# Altium schematic sheet PIEZO_ver2_sheet1.SchDoc
size A4
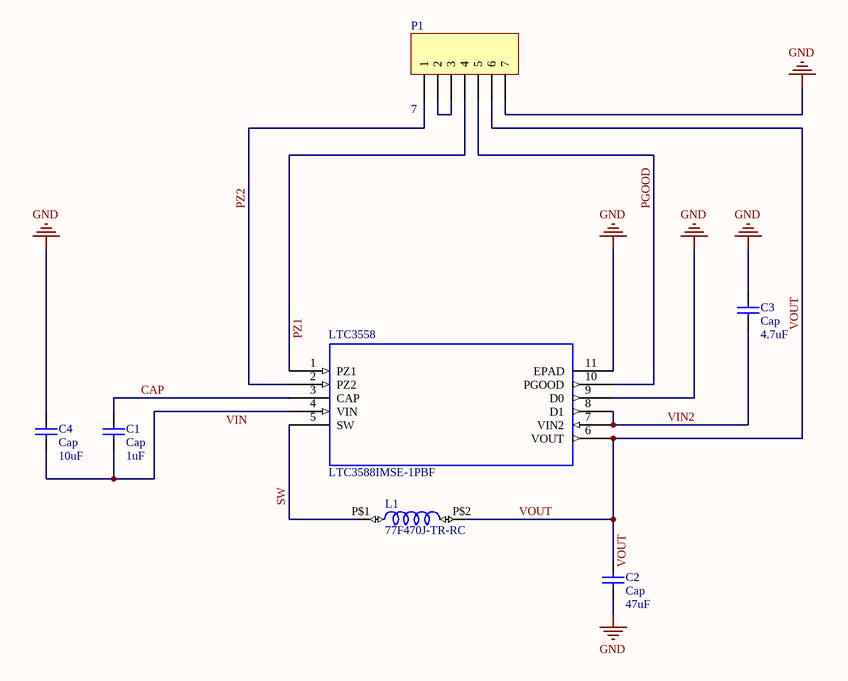
[diagram p0: PIEZO_ver2_sheet1.SchDoc]

## Parts
C1  Cap  value 1uF  [RAD-0.2]
C2  Cap  value 47uF  [RAD-0.2]
C3  Cap  value 4.7uF  [PCBComponent_1]
C4  Cap  value 10uF  [CAPPRD500W50D500H1100]
L1  77F470J-TR-RC  [77F]
LTC3558  LTC3588IMSE-1PBF  [MSOP-10_MSE]
P1  7  [HDR1X7]

## Nets
GND: C2.1 C3.2 C4.2 LTC3558.9(D0) LTC3558.11(EPAD) P1.7
CAP: C1.2 LTC3558.3(CAP)
PGOOD: LTC3558.10(PGOOD) P1.5
PZ1: LTC3558.1(PZ1) P1.4
PZ2: LTC3558.2(PZ2) P1.1
SW: L1.P$1 LTC3558.5(SW)
VIN: C1.1 C4.1 LTC3558.4(VIN)
VIN2: C3.1 LTC3558.7(VIN2) LTC3558.8(D1)
VOUT: C2.2 L1.P$2 LTC3558.6(VOUT) P1.6
NetP1_2: P1.2 P1.3

## Library data of the parts
C1-C4 = Cap: Capacitor; Published: 8-Jun-2000; LatestRevisionDate: 17-Jul-2002; LatestRevisionNote: Re-released for DXP Platform.; PackageReference: RAD-0.3; Publisher: Altium Limited; PackageDescription: Radial Cap, Thru-Hole; 2 Leads; 0.3 in Pin Spacing
L1 = 77F470J-TR-RC: 47 ÂµH Unshielded Drum Core, Wirewound Inductor 340 mA 1.3Ohm Max Axial; MF: Bourns; SnapEDA_Link: https://www.snapeda.com/parts/77F470J-TR-RC/Bourns/view-part/?ref=snap; Package: Package; Value: *; MP: 77F470J-TR-RC; Check_prices: https://www.snapeda.com/parts/77F470J-TR-RC/Bourns/view-part/?ref=eda
P1 = Header 7: Header, 7-Pin; LatestRevisionDate: 17-Jul-2002; LatestRevisionNote: Re-released for DXP Platform.; Publisher: Altium Limited
LTC3558 = LTC3588IMSE-1PBF: Package: None; Price: None; Value: *; MP: LTC3588IMSE-1PBF; Availability: Unavailable